# EAGLE design xmaslights (EAGLE 7.2.0)
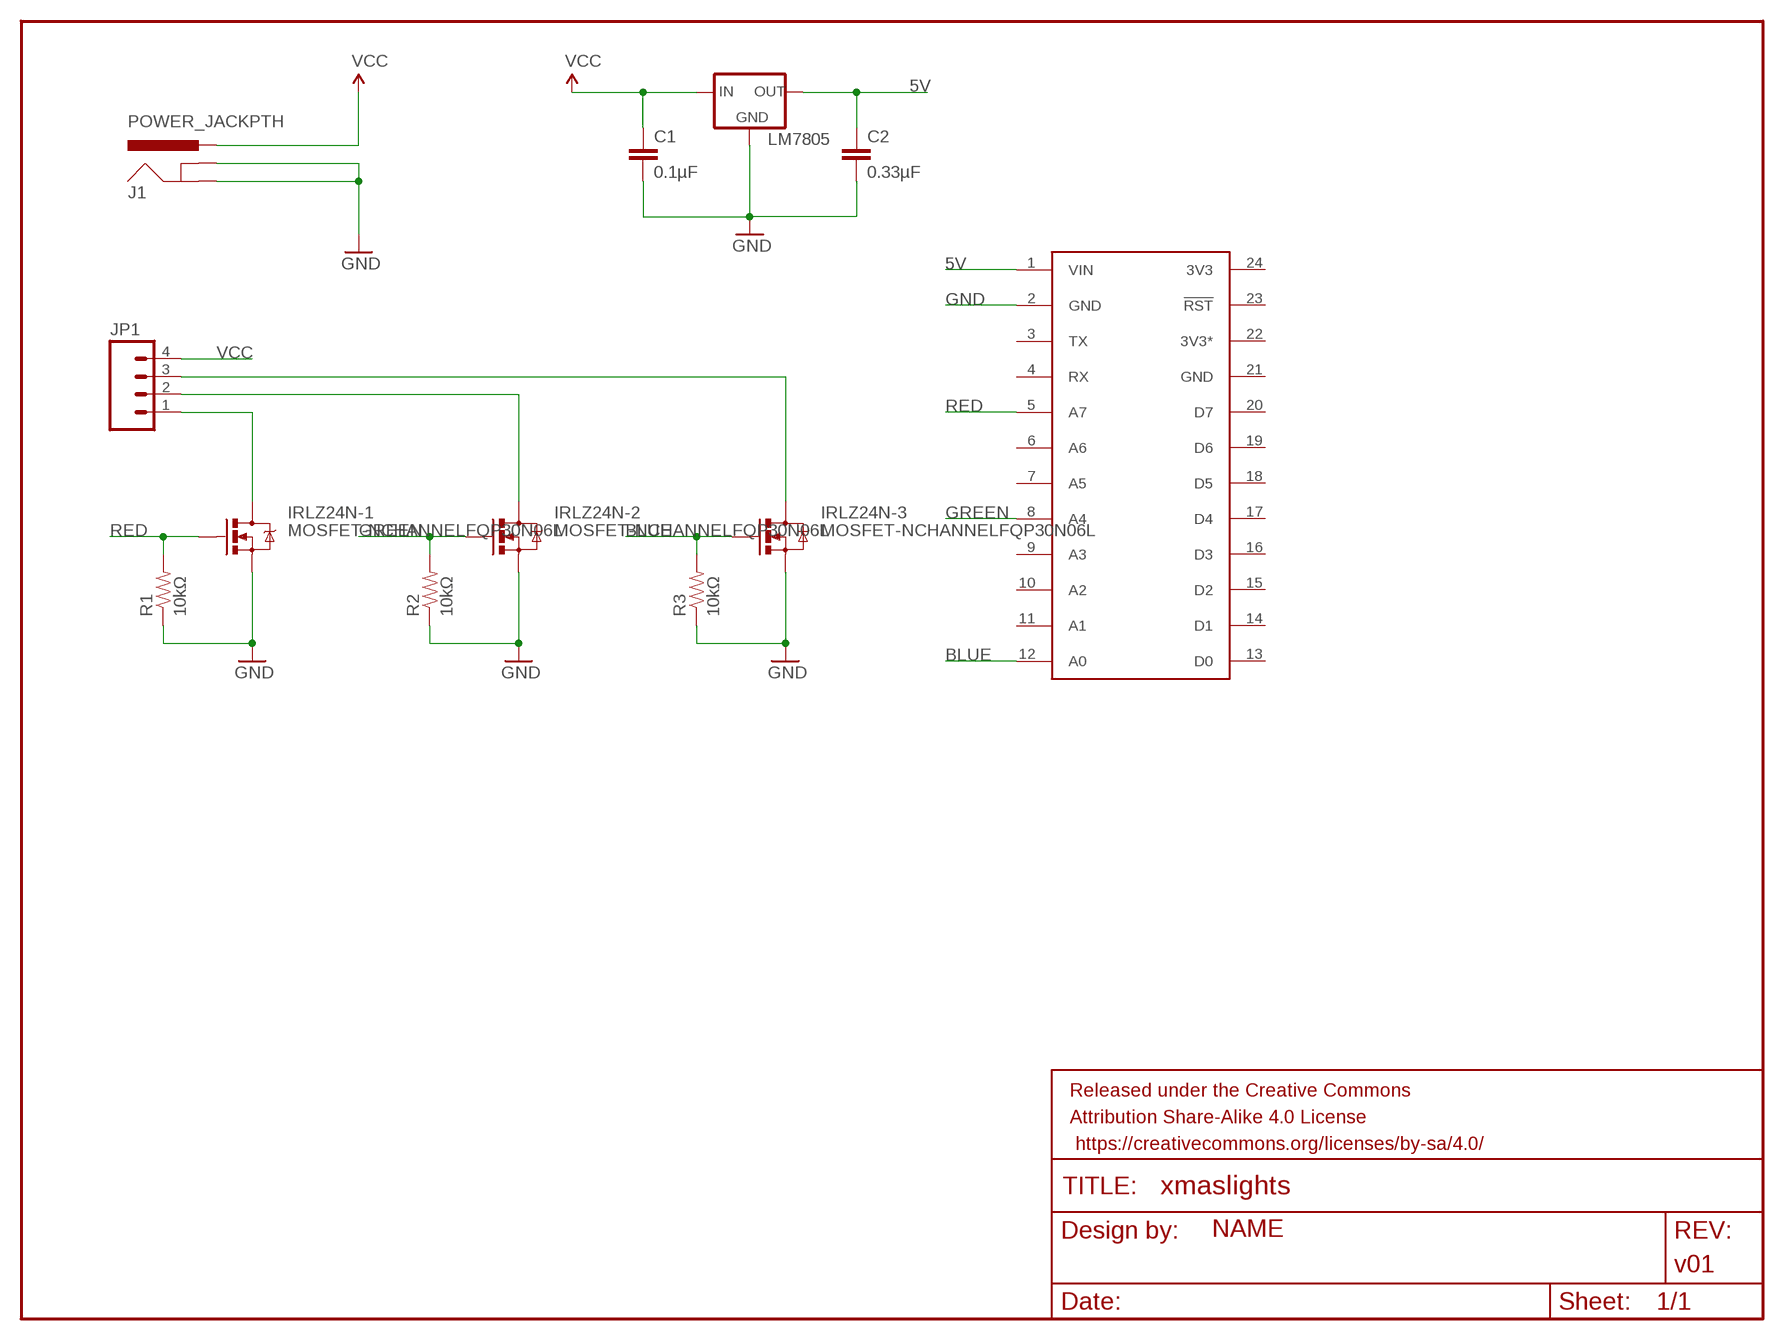
[diagram p0: schematic, sheet 1]

## Parts
C1  0.1µF  CAPPTH  [CAP-PTH-SMALL]
C2  0.33µF  CAPPTH  [CAP-PTH-SMALL]
FRAME1  FRAME-LETTER  [CREATIVE_COMMONS]
IRLZ24N-1  MOSFET-NCHANNELFQP30N06L  [TO220V]
IRLZ24N-2  MOSFET-NCHANNELFQP30N06L  [TO220V]
IRLZ24N-3  MOSFET-NCHANNELFQP30N06L  [TO220V]
J1  POWER_JACKPTH  [POWER_JACK_PTH]
JP1  M04PTH  [1X04]
LM7805  V_REG_78XXSINK  [TO220-IGO]
R1  10kΩ  RESISTORPTH-1/4W  [AXIAL-0.4]
R2  10kΩ  RESISTORPTH-1/4W  [AXIAL-0.4]
R3  10kΩ  RESISTORPTH-1/4W  [AXIAL-0.4]
U$1  SPARK_CORECORE  [SPARK_CORE]

## Nets
5V: C2.1 LM7805.OUT U$1.1(VIN)
BLUE: IRLZ24N-3.1(G) R3.P$2 U$1.12(A0)
GND: C1.2 C2.2 IRLZ24N-1.3(S) IRLZ24N-2.3(S) IRLZ24N-3.3(S) J1.GND J1.GNDBREAK LM7805.GND R1.P$1 R2.P$1 R3.P$1 U$1.2(GND)
GREEN: IRLZ24N-2.1(G) R2.P$2 U$1.8(A4)
N$1: IRLZ24N-1.2(D) JP1.1
N$2: IRLZ24N-2.2(D) JP1.2
N$3: IRLZ24N-3.2(D) JP1.3
RED: IRLZ24N-1.1(G) R1.P$2 U$1.5(A7)
VCC: C1.1 J1.PWR JP1.4 LM7805.IN
Unconnected: U$1.3(TX) U$1.4(RX) U$1.6(A6) U$1.7(A5) U$1.9(A3) U$1.10(A2) U$1.11(A1) U$1.13(D0) U$1.14(D1) U$1.15(D2) U$1.16(D3) U$1.17(D4) U$1.18(D5) U$1.19(D6) U$1.20(D7) U$1.23(!RST)

## Power pins joined to a net without a drawn wire
3V3: U$1.24(3V3)
3V3*: U$1.22(3V3*)
GND: U$1.21(GND)

## Library data of the parts
C1 C2 = SparkFun-Capacitors:CAP: Capacitor Standard 0603 ceramic capacitor, and 0.1" leaded capacitor.
FRAME1 = SparkFun-Aesthetics:FRAME-LETTER: Schematic Frame Standard 8.5x11 US Letter frame; DESIGNER: NAME; VERSION: v01
IRLZ24N-1-IRLZ24N-3 = SparkFun-DiscreteSemi:MOSFET-NCHANNEL: Common NMOSFET Parts MFG P/N Store ID Prod ID FDD8780 TRANS-09984 SI7820DN TRANS-11055 FDS6630A IC-08089 2N7002PW TRANS-11151 FQP30N06L COM-10213 TRANS-10060 BSS123LT1G TRANS-08345 BSS138 TRANS-00830 BS170 2N7000; PROD_ID: TRANS-10060
J1 = Spark:POWER_JACK: Power Jack This is the standard 5.5mm barrel jack for power. The PTH is the most common, proven, reliable, footprint. The Slot footprint only works if the mill layer is transmitted to the PCB fab house so be warned. Spark Fun Electronics SKU : PRT-00119 SMT: CONN-08106 Mating wall wart : TOL-00298 (and others)
JP1 = SparkFun-Connectors:M04: Header 4 Standard 4-pin 0.1" header. Use with straight break away headers (SKU : PRT-00116), right angle break away headers (PRT-00553), swiss pins (PRT-00743), machine pins (PRT-00117), and female headers (PRT-00115). Molex polarized connector foot print use with SKU : PRT-08231 with associated crimp pins and housings. 1MM SMD Version SKU: PRT-10208
LM7805 = SparkFun-PowerIC:V_REG_78XX: Voltage Regulator Standard 7805 5V regulator. IGO (Input Ground Output). Spark Fun Electronics SKU : COM-00107
R1-R3 = SparkFun-Passives:RESISTOR: Resistor Basic schematic elements and footprints for 0603, 1206, and PTH resistors.
U$1 = Spark:SPARK_CORE

## Net classes
1 power: width 0.066 mm, clearance 0.003 mm

## Board
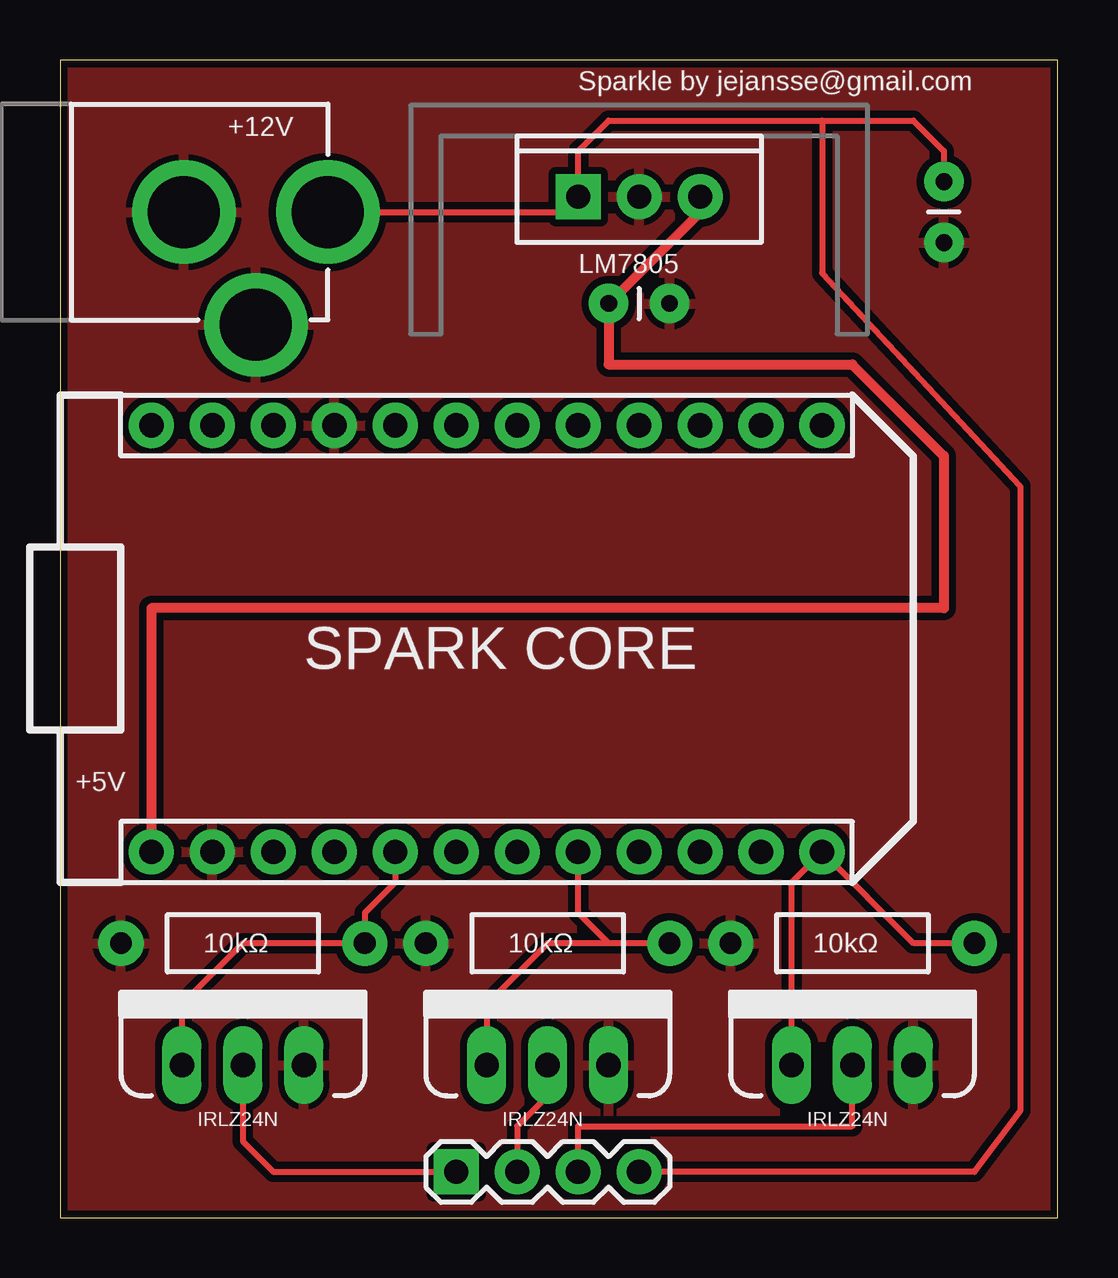
[diagram p1: board, top side]

Size 41.58 x 48.25 mm. Coordinates in mm from the lower left corner, seen from the top.
Outline: 0,0 41.58,0 41.58,48.25 0,48.25 0,0
Copper layers (1*16): Top 0.035mm / dielectric 1.5mm / Bottom 0.035mm
Design rules "SparkFun *": minimum track width 8mil, minimum drill 20mil, track to track 8mil, track to pad 8mil, pad to pad 8mil, via to via 8mil, smd to smd 8mil, copper to edge 8mil, drill to drill 8mil, minimum pad ring 12mil, minimum via ring 10mil, stop-mask expansion 4mil, vias tented up to drill 20mil, thermal gap 10mil

### Footprints (pad centres in the part's own frame; a part is rotated, then mirrored left to right if it is on the bottom)
CAP-PTH-SMALL = drill 0.7 pad 1.651: 1 0,0; 2 2.54,0
TO220V = drill 1.016 long: 1 -2.54,0; 2 0,0; 3 2.54,0
POWER_JACK_PTH = drill 2.997 pad 4.318: GND 0,7.7; GNDBREAK 4.7,10.7; PWR 0,13.7
1X04 = drill 1.016 pad 1.88 square: 1 0,0 | drill 1.016 pad 1.88: 2 2.54,0; 3 5.08,0; 4 7.62,0
TO220-IGO = drill 1 pad 1.88: GND 0,0; OUT 2.54,0 | drill 1 pad 1.88 square: IN -2.54,0
AXIAL-0.4 = drill 0.9 pad 1.88: P$1 -5.08,0; P$2 5.08,0
SPARK_CORE = drill 1.016 pad 1.88: 1 -8.89,13.97; 2 -8.89,11.43; 3 -8.89,8.89; 4 -8.89,6.35; 5 -8.89,3.81; 6 -8.89,1.27; 7 -8.89,-1.27; 8 -8.89,-3.81; 9 -8.89,-6.35; 10 -8.89,-8.89; 11 -8.89,-11.43; 12 -8.89,-13.97; 13 8.89,-13.97; 14 8.89,-11.43; 15 8.89,-8.89; 16 8.89,-6.35; 17 8.89,-3.81; 18 8.89,-1.27; 19 8.89,1.27; 20 8.89,3.81; 21 8.89,6.35; 22 8.89,8.89; 23 8.89,11.43; 24 8.89,13.97

### Placement (x,y rotation side)
C1  36.83,43.18 270 top
C2  22.86,38.1 0 top
FRAME1  -77.47,57.15 0 top  (outside the outline)
IRLZ24N-1  7.62,6.35 0 top
IRLZ24N-2  20.32,6.35 0 top
IRLZ24N-3  33.02,6.35 0 top
J1  -2.54,41.91 270 top
JP1  16.51,1.91 0 top
LM7805  24.13,42.55 0 top
R1  7.62,11.43 0 top
R2  20.32,11.43 0 top
R3  33.02,11.43 0 top
U$1  17.78,24.13 90 top

### Tracks (layer width: path | path; a pad name or v marks a point on that pad's centre or on a via)
5V
  Top 0.406: LM7805.OUT 26.67,41.91 C2.1 22.86,35.56 33.02,35.56 36.83,31.75 36.83,25.4 3.81,25.4 U$1.1
BLUE
  Top 0.254: R3.P$2 35.56,11.43 U$1.12 30.48,13.97 IRLZ24N-3.1
GND
  pour Top (isolate 0.305): 0,0 0,48.26 41.91,48.26 41.91,0
GREEN
  Top 0.254: U$1.8 21.59,12.7 22.86,11.43 R2.P$2 20.32,11.43 17.78,8.89 IRLZ24N-2.1
N$1
  Top 0.254: IRLZ24N-1.2 7.62,3.17 8.89,1.91 JP1.1
N$2
  Top 0.254: IRLZ24N-2.2 20.32,5.08 19.05,3.81 JP1.2
  Top 0.406: 19.05,1.27 JP1.2
N$3
  Top 0.254: 21.59,2.54 21.59,3.81 33.02,3.81 IRLZ24N-3.2
  Top 0.406: 21.59,2.54 JP1.3
RED
  Top 0.254: U$1.5 13.97,13.97 12.7,12.7 R1.P$2 7.62,11.43 5.08,8.89 IRLZ24N-1.1
VCC
  Top 0.254: 31.75,45.72 35.56,45.72 36.83,44.45 C1.1 | 31.75,45.72 22.86,45.72 21.59,44.45 LM7805.IN 20.95,41.91 J1.PWR | 31.75,45.72 31.75,39.37 40.01,30.48 40.01,4.45 38.1,1.91 JP1.4

### Text on the board
tNames: Sparkle by jejansse@gmail.com | +12V | LM7805 | SPARK CORE | +5V | IRLZ24N | IRLZ24N | IRLZ24N